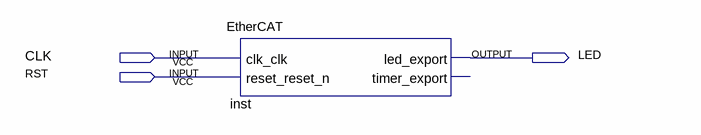
[diagram p0: schematic sheet]
// Quartus schematic ViCAT_LSC_ML_Proj.bdf as structural Verilog: 1 symbols, 3 pins
module ViCAT_LSC_ML_Proj (
  input  CLK,
  input  RST,
  output LED
);

  EtherCAT inst (.clk_clk(CLK), .reset_reset_n(RST), .led_export(LED));  // open: timer_export
endmodule
